# Altium schematic sheet Shematic.SchDoc
size A4; Author: MCUdude; Revision: 0; SheetNumber: 1; SheetTotal: 1
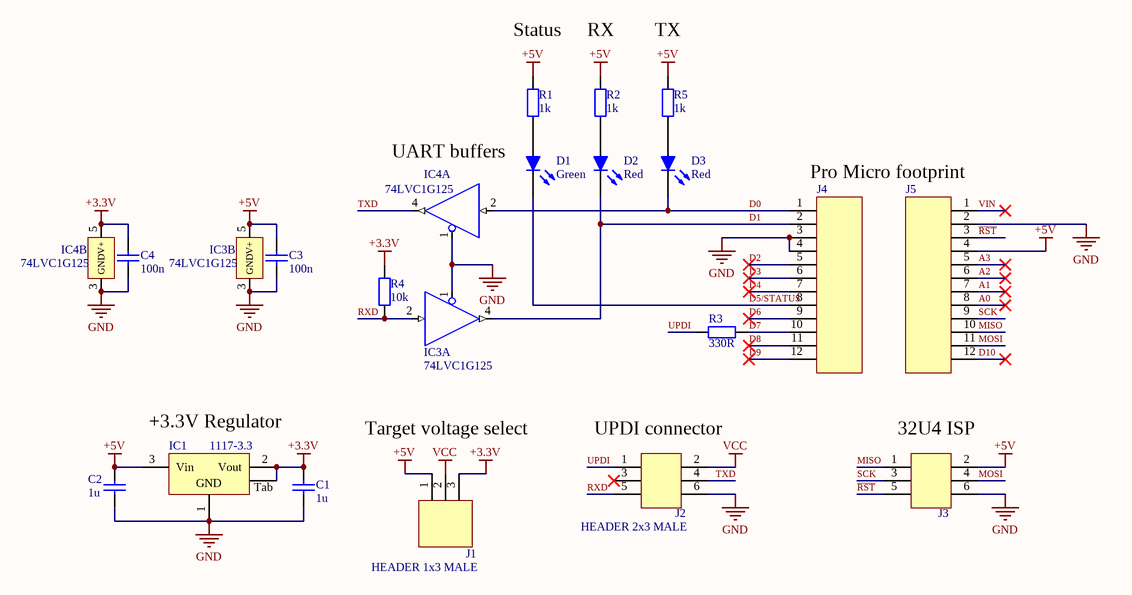
[diagram p0: Shematic.SchDoc]

## Parts
C1  value 1u  [0805 CAPACITOR]  (hidden comment: Generic bipolar capacitor)
C2  value 1u  [0805 CAPACITOR]  (hidden comment: Generic bipolar capacitor)
C3  value 100n  [0805 CAPACITOR]  (hidden comment: Generic bipolar capacitor)
C4  value 100n  [0805 CAPACITOR]  (hidden comment: Generic bipolar capacitor)
D1  Green  [LED-GREEN-0805]
D2  Red  [LED-RED-0805]
D3  Red  [LED-RED-0805]
IC1  1117-3.3  [SOT-223]
IC3  74LVC1G125  [SOT-353]  (parts A,B of 2)
IC4  74LVC1G125  [SOT-353]  (parts A,B of 2)
J1  HEADER 1x3 MALE  [HEADER-MALE-STRAIGHT-1x3-LOCKED]
J2  HEADER 2x3 MALE  [HEADER-MALE-STRAIGHT-2x3-LOCKED]
J3  HEADER 2x3 MALE  [HEADER-MALE-STRAIGHT-2x3-LOCKED]  (value not drawn)  (no BOM)
J4  HEADER 1x12 FEMALE  [HEADER-FEMALE-STRAIGHT-1x12]  (value not drawn)  (no BOM)
J5  HEADER 1x12 FEMALE  [HEADER-FEMALE-STRAIGHT-1x12]  (value not drawn)  (no BOM)
R1  value 1k  [0805 RESISTOR]  (hidden comment: Generic resistor)
R2  value 1k  [0805 RESISTOR]  (hidden comment: Generic resistor)
R3  value 330R  [0805 RESISTOR]  (hidden comment: Generic resistor)
R4  value 10k  [0805 RESISTOR]  (hidden comment: Generic resistor)
R5  value 1k  [0805 RESISTOR]  (hidden comment: Generic resistor)

## Nets
+3.3V: C1.2 C4.2 IC1.2(Vout) IC1.4 IC4.5(V+) J1.3 R4.2
+5V: C2.2 C3.2 IC1.3(Vin) IC3.5(V+) J1.1 J3.2 J5.4 R1.1 R2.1 R5.1
GND: C1.1 C2.1 C3.1 C4.1 IC1.1(GND) IC3.1(~{OE}) IC3.3(GND) IC4.1(~{OE}) IC4.3(GND) J2.6 J3.6 J4.3 J4.4 J5.2
VCC: J1.2 J2.2
~{RST}: J3.5 J5.3
A0: J5.8
A1: J5.7
A2: J5.6
A3: J5.5
D0: D3.K IC4.2(IN-) J4.1
D1: D2.K IC3.4(OUT) J4.2
D2: J4.5
D3: J4.6
D4: J4.7
D5/STATUS: D1.K J4.8
D6: J4.9
D7: J4.10 R3.1
D8: J4.11
D9: J4.12
D10: J5.12
MISO: J3.1 J5.10
MOSI: J3.4 J5.11
RXD: IC3.2(IN-) J2.5 R4.1
SCK: J3.3 J5.9
TXD: IC4.4(OUT) J2.4
UPDI: J2.1 R3.2
VIN: J5.1
NetD1_A: D1.A R1.2
NetD2_A: D2.A R2.2
NetD3_A: D3.A R5.2

Not connected (* = marked no-connect by the designer): J2 3*

## Notes on the sheet
- Status
- RX
- TX
- UART buffers
- Pro Micro footprint
- +3.3V Regulator
- Target voltage select
- (near J2) UPDI connector
- (near J3) 32U4 ISP
- File name:
- Project name:
- Board name:
- Author:
- MCUdude
- Rev:
- Last edited:
- Page number:
- Total pages:
- (in symbol REG-POS-3.3V-1117) Tab

## Library data of the parts
C1 C2 = CAP-CER-0805-1U-16V: Cap Ceramic 0805 1u 16V Y5V; Notes: Generic, choose one that meets spec; Package: 0805; Laud Number: *; Component type: Capacitor; Voltage rating: 16V; Tolerence: *; Dielectric: Y5V; Topro Art. nr: *
C3 C4 = CAP-CER-0805-100N-50V: Cap Ceramic 0805 100n 50V X7R; Notes: Generic, choose one that meets spec; Package: 0805; Laud Number: *; Component type: Capacitor; Voltage rating: 50V; Tolerence: *; Dielectric: X7R; Topro Art. nr: *
D1 = LED-0805-GREEN: LED 0805 Green; Manufacturer: *; Manufacturer Part Number: *; Component Type: LED; Package: 0805
D2 D3 = LED-0805-RED: LED 0805 Red; Manufacturer: *; Manufacturer Part Number: *; Component Type: LED; Package: 0805
IC1 = REG-POS-3.3V-1117: Positive 3.3V regulator 1A SOT-223; Notes: Generic 1117-3.3; Manufacturer: *; Manufacturer Part Number: 1117-3.3; Laud Number: *; Package: SOT-223; Topro Art. Nr: *; Component type: IC
IC3 IC4 = IC-74LVC1G125: Singe Buffer with 3-State Output; Manufacturer: *; Manufacturer Part Number: 74LVC1G125; Component Type: IC; Package: SOT-353
J1 = CON-HEADER-MALE-STRAIGHT-1x3: Header male straight 1x3; Component type: Connector
J2 J3 = CON-HEADER-MALE-STRAIGHT-2x3: Header male straight 2x3; Component Type: Connector
J4 J5 = CON-HEADER-FEMALE-STRAIGHT-1x12: Header female straight 1x12; Component type: Connector
R1 R2 R5 = RES-0805-1k: Resistor 0805 1k 1%; Notes: Generic, choose one that meets spec; Topro Art. nr: *; Component Type: Resistor; Tolerence: 1%; Manufacturer Part Number: *; Manufacturer: *; Package: 0805; Laud Number: *
R3 = RES-0805-330R: Resistor 0805 330R 1%; Notes: Generic, choose one that meets spec; Topro Art. nr: *; Component Type: Resistor; Manufacturer Part Number: *; Manufacturer: *; Package: 0805
R4 = RES-0805-10k: Resistor 0805 10k 1%; Notes: Generic, choose one that meets spec; Topro Art. nr: *; Component Type: Resistor; Manufacturer Part Number: *; Manufacturer: *; Package: 0805